# EasyEDA schematic KegWasher_1.8_LogicIO_Schematic.json
TITLE: Keg Washer Pi (Logic & IO) 1.8; REV: 1.8; Date: 2020-08-18; Sheet: 1/1; Drawn By: khultman; Company: Kyle Hultman
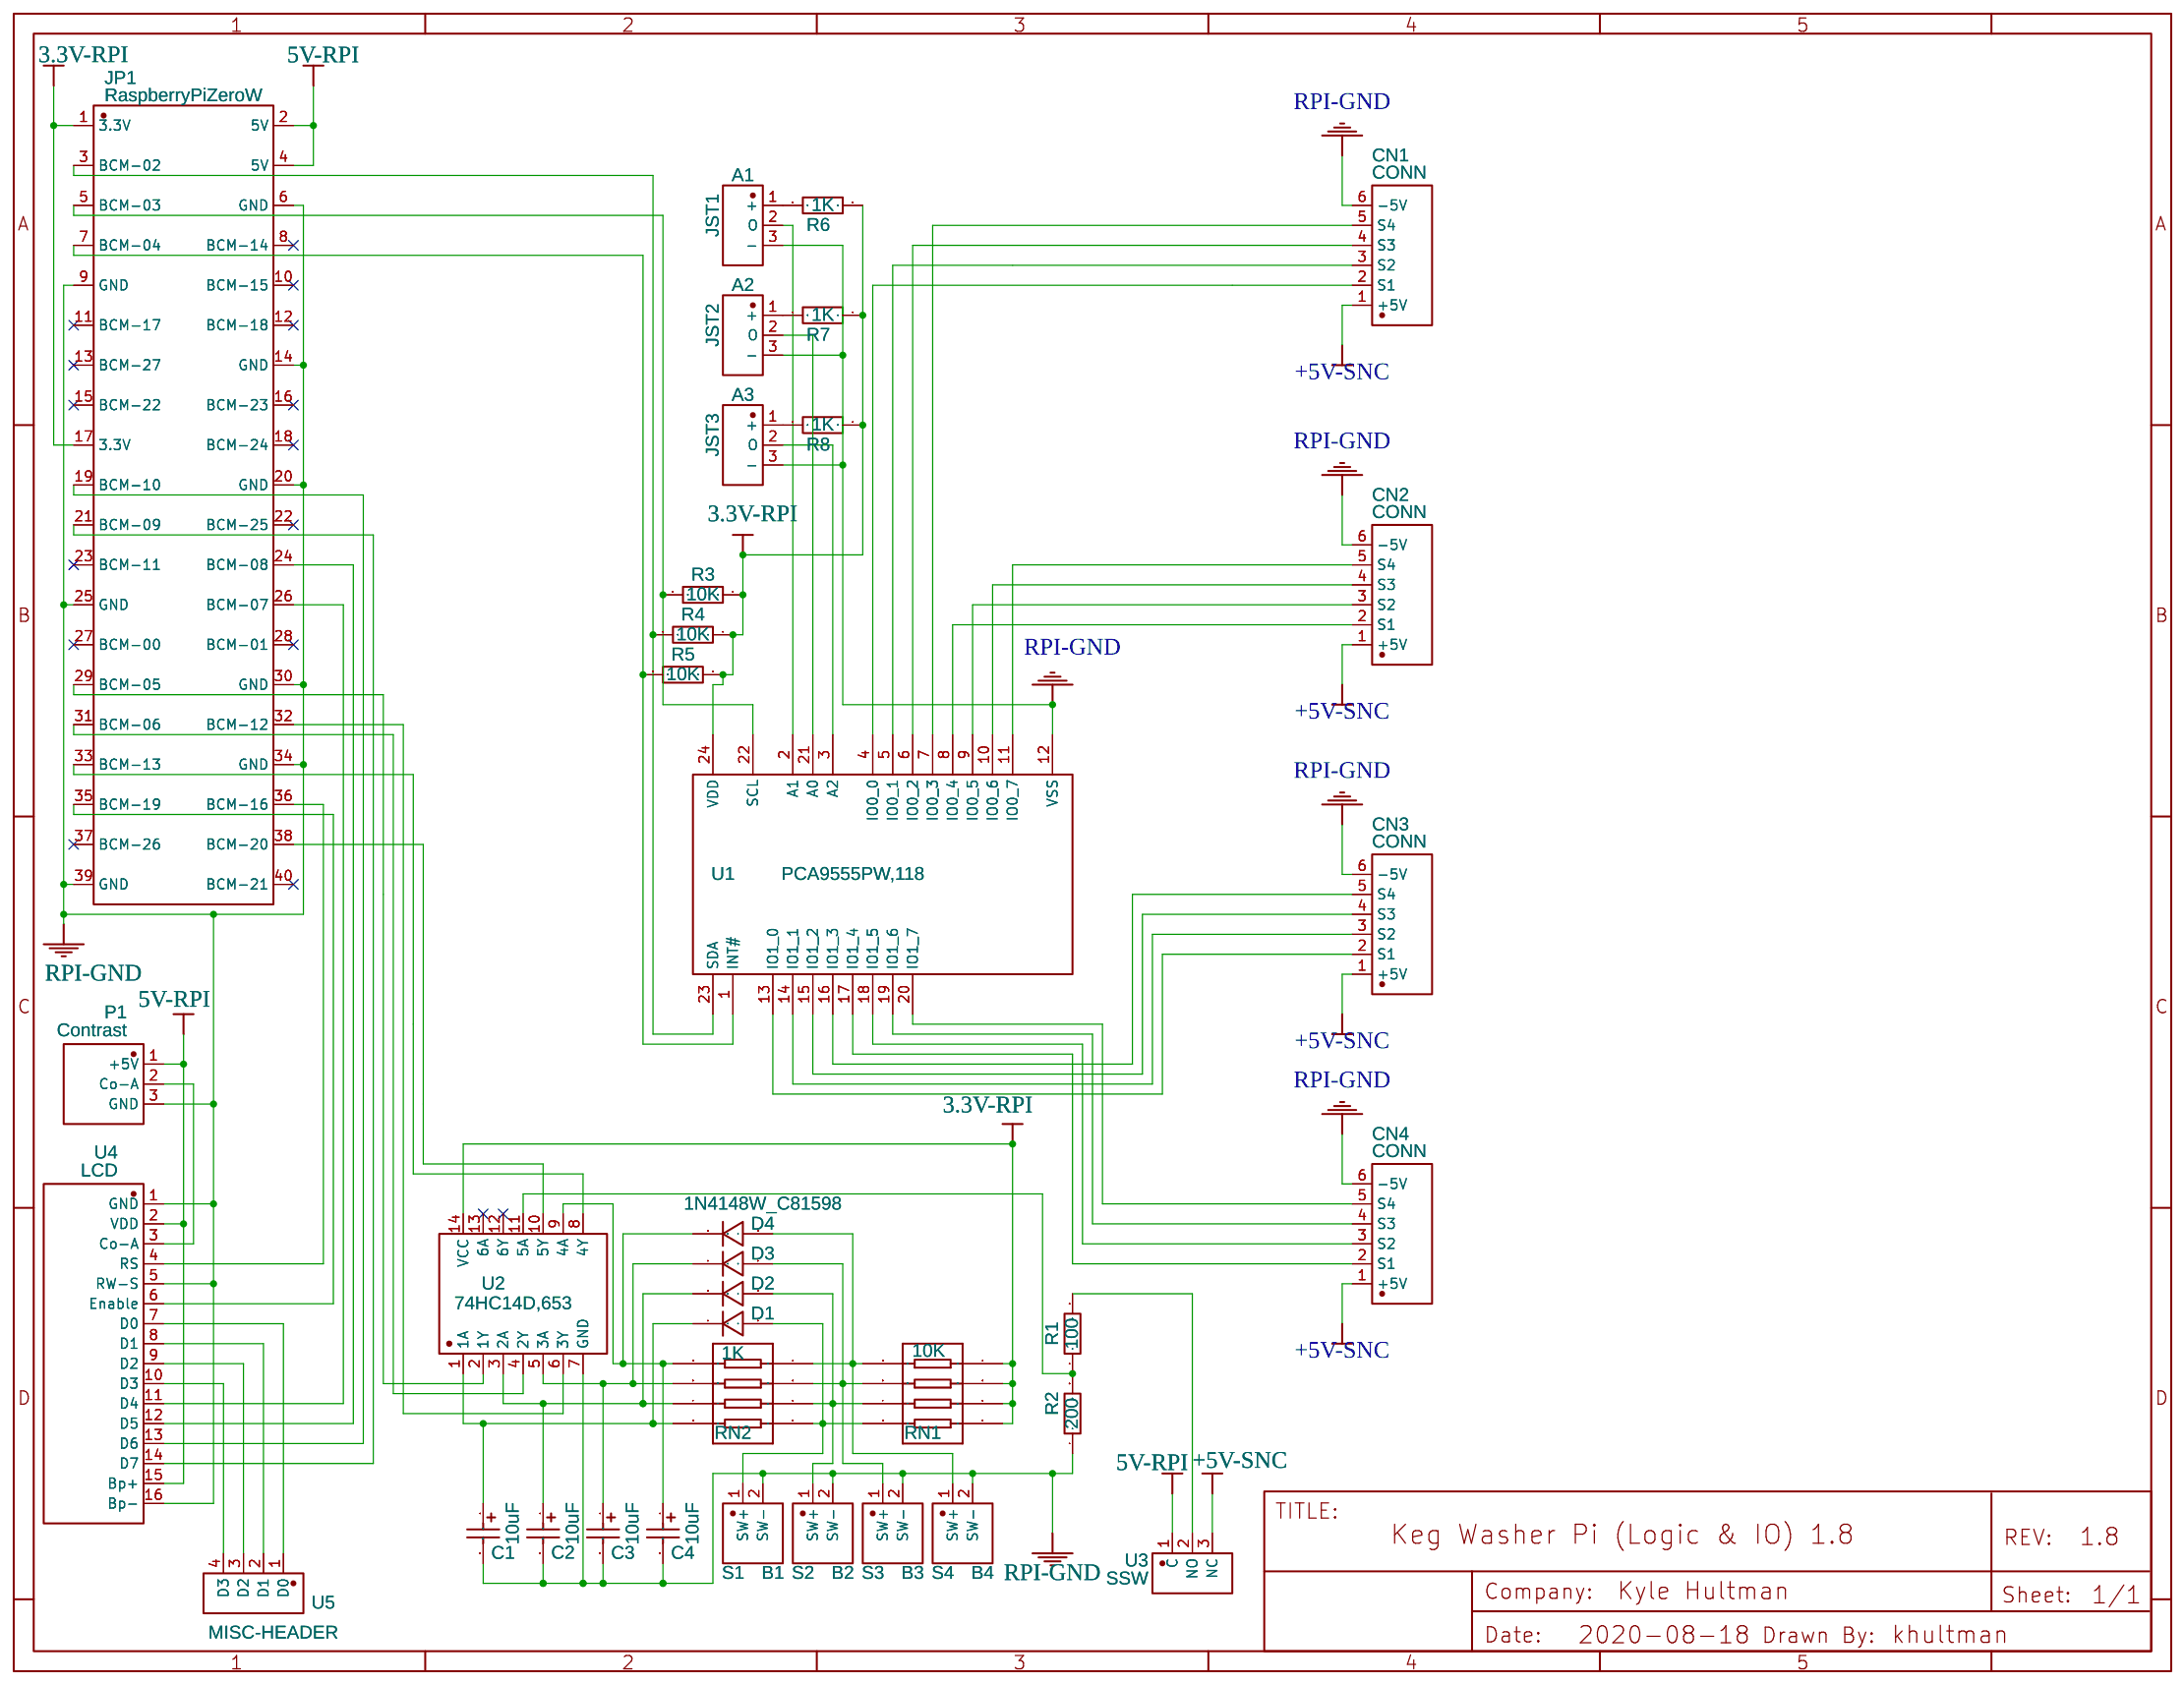
[diagram p0: schematic sheet]

## Parts
C1  10uF  [CAP-SMD_L3.2-W1.6-R-RD]
C2  10uF  [CAP-SMD_L3.2-W1.6-R-RD]
C3  10uF  [CAP-SMD_L3.2-W1.6-R-RD]
C4  10uF  [CAP-SMD_L3.2-W1.6-R-RD]
CN1  CONN  [6P]
CN2  CONN  [6P]
CN3  CONN  [6P]
CN4  CONN  [6P]
D1  1N4148W_C81598  [SOD-123_L2.8-W1.8-LS3.7-RD]
D2  1N4148W_C81598  [SOD-123_L2.8-W1.8-LS3.7-RD]
D3  1N4148W_C81598  [SOD-123_L2.8-W1.8-LS3.7-RD]
D4  1N4148W_C81598  [SOD-123_L2.8-W1.8-LS3.7-RD]
JP1  RaspberryPiZeroW  [2X20-SHROUDED]
JST1  A1  [3P]
JST2  A2  [3P]
JST3  A3  [3P]
P1  Contrast  [3P]
R1  100  [R1206]
R2  200  [R0603]
R3  10K  [R1206]
R4  10K  [R1206]
R5  10K  [R1206]
R6  1K  [R0805]
R7  1K  [R0805]
R8  1K  [R0805]
RN1  10K  [RES-ARRAY-SMD_0402-8P-L2.0-W1.0-BL]
RN2  1K  [RES-ARRAY-SMD_0402-8P-L2.0-W1.0-BL]
S1  B1  [2P]
S2  B2  [2P]
S3  B3  [2P]
S4  B4  [2P]
U1  PCA9555PW,118  [TSSOP-24_L7.8-W4.4-P0.65-LS6.4-BL]
U2  74HC14D,653  [SOIC-14_L8.7-W3.9-P1.27-LS6.0-BL]
U3  SSW  [3P]
U4  LCD  [HDR-M-2.54_1X16]
U5  MISC-HEADER  [HDR-M-2.54_1X4]

## Library data of the parts
C1-C4 = TAJA106K016RNJ: Supplier: LCSC; Manufacturer: AVX; LCSC Assembly: Yes; Supplier Part: C7171; SMT Type: Basic
CN1-CN4 = CONN
D1-D4 = 1N4148W_C81598: Supplier: LCSC; Manufacturer: SEMTECH; Manufacturer Part: 1N4148W; image: //image.lceda.cn/szlcsc/C81598.jpg; Supplier Part: C81598; LCSC Assembly: Yes; SMT Type: Basic
JP1 = RaspberryPiZeroW
JST1-JST3 = JST1
P1 = Contrast
R1 = 1206W4F1000T5E: Supplier: LCSC; Manufacturer: UniOhm; LCSC Assembly: Yes; Supplier Part: C17901; SMT Type: Basic
R2 = 0603WAF2000T5E: Supplier: LCSC; Manufacturer: UniOhm; LCSC Assembly: Yes; Supplier Part: C8218; SMT Type: Basic
R3-R5 = 1206W4F1002T5E: Supplier: LCSC; Manufacturer: UniOhm; LCSC Assembly: Yes; Supplier Part: C17902; SMT Type: Basic
R6-R8 = 0805W8F1001T5E: Supplier: LCSC; Manufacturer: UniOhm; LCSC Assembly: Yes; Supplier Part: C17513; SMT Type: Basic
RN1 = 4D02WGJ0103TCE: Supplier: LCSC; Manufacturer: UniOhm; LCSC Assembly: Yes; Supplier Part: C25725; SMT Type: Basic
RN2 = 4D02WGJ0102TCE: Supplier: LCSC; Manufacturer: UniOhm; LCSC Assembly: Yes; Supplier Part: C25726; SMT Type: Basic
S1-S4 = SW
U1 = PCA9555PW,118: Supplier: LCSC; Manufacturer: NXP; Contributor: LCSC; Supplier Part: C128392; LCSC Assembly: Yes; SMT Type: Extend
U2 = 74HC14D,653: Supplier: LCSC; Manufacturer: Nexperia; LCSC Assembly: Yes; image: //image.lceda.cn/szlcsc/C5605.jpg; Supplier Part: C5605; SMT Type: Basic
U3 = SSW
U4 = LCD
U5 = MISC-HEADER

## Nets
3.3V-RPI: JP1.1(3.3V) JP1.17(3.3V) R3.1 R4.1 R5.1 R6.1 R7.1 R8.1 RN1.1 RN1.2 RN1.3 RN1.4 U1.24(VDD) U2.14(VCC)
5V-RPI: JP1.2(5V) JP1.4(5V) P1.1(+5V) U3.1(C) U4.2(VDD) U4.15(Bp+)
+5V-SNC: CN1.1(+5V) CN2.1(+5V) CN3.1(+5V) CN4.1(+5V) U3.3(NC)
RPI-GND: C1.2 C2.2 C3.2 C4.2 CN1.6(-5V) CN2.6(-5V) CN3.6(-5V) CN4.6(-5V) JP1.6(GND) JP1.9(GND) JP1.14(GND) JP1.20(GND) JP1.25(GND) JP1.30(GND) JP1.34(GND) JP1.39(GND) JST1.3(-) JST2.3(-) JST3.3(-) P1.3(GND) R2.1 S1.2(SW-) S2.2(SW-) S3.2(SW-) S4.2(SW-) U1.12(VSS) U2.7(GND) U4.1(GND) U4.5(RW-S) U4.16(Bp-)
Net-(C1-1): C1.1 D1.1(K) RN2.8 U2.1(1A)
Net-(C2-1): C2.1 D2.1(K) RN2.7 U2.3(2A)
Net-(C3-1): C3.1 D3.1(K) RN2.6 U2.5(3A)
Net-(C4-1): C4.1 D4.1(K) RN2.5 U2.9(4A)
Net-(CN1-2): CN1.2(S1) U1.4(IO0_0)
Net-(CN1-3): CN1.3(S2) U1.5(IO0_1)
Net-(CN1-4): CN1.4(S3) U1.6(IO0_2)
Net-(CN1-5): CN1.5(S4) U1.7(IO0_3)
Net-(CN2-2): CN2.2(S1) U1.8(IO0_4)
Net-(CN2-3): CN2.3(S2) U1.9(IO0_5)
Net-(CN2-4): CN2.4(S3) U1.10(IO0_6)
Net-(CN2-5): CN2.5(S4) U1.11(IO0_7)
Net-(CN3-2): CN3.2(S1) U1.13(IO1_0)
Net-(CN3-3): CN3.3(S2) U1.14(IO1_1)
Net-(CN3-4): CN3.4(S3) U1.15(IO1_2)
Net-(CN3-5): CN3.5(S4) U1.16(IO1_3)
Net-(CN4-2): CN4.2(S1) U1.17(IO1_4)
Net-(CN4-3): CN4.3(S2) U1.18(IO1_5)
Net-(CN4-4): CN4.4(S3) U1.19(IO1_6)
Net-(CN4-5): CN4.5(S4) U1.20(IO1_7)
Net-(D1-2): D1.2(A) RN1.8 RN2.1 S1.1(SW+)
Net-(D2-2): D2.2(A) RN1.7 RN2.2 S2.1(SW+)
Net-(D3-2): D3.2(A) RN1.6 RN2.3 S3.1(SW+)
Net-(D4-2): D4.2(A) RN1.5 RN2.4 S4.1(SW+)
Net-(JP1-3): JP1.3(BCM-02) R4.2 U1.23(SDA)
Net-(JP1-5): JP1.5(BCM-03) R3.2 U1.22(SCL)
Net-(JP1-7): JP1.7(BCM-04) R5.2 U1.1(INT#)
Net-(JP1-19): JP1.19(BCM-10) U4.13(D6)
Net-(JP1-21): JP1.21(BCM-09) U4.14(D7)
Net-(JP1-24): JP1.24(BCM-08) U4.12(D5)
Net-(JP1-26): JP1.26(BCM-07) U4.11(D4)
Net-(JP1-29): JP1.29(BCM-05) U2.2(1Y)
Net-(JP1-31): JP1.31(BCM-06) U2.4(2Y)
Net-(JP1-32): JP1.32(BCM-12) U2.6(3Y)
Net-(JP1-33): JP1.33(BCM-13) U2.8(4Y)
Net-(JP1-35): JP1.35(BCM-19) U4.6(Enable)
Net-(JP1-36): JP1.36(BCM-16) U4.4(RS)
Net-(JP1-38): JP1.38(BCM-20) U2.10(5Y)
Net-(JST1-1): JST1.1(+) R6.2
Net-(JST1-2): JST1.2(O) U1.2(A1)
Net-(JST2-1): JST2.1(+) R7.2
Net-(JST2-2): JST2.2(O) U1.21(A0)
Net-(JST3-1): JST3.1(+) R8.2
Net-(JST3-2): JST3.2(O) U1.3(A2)
Net-(P1-2): P1.2(Co-A) U4.3(Co-A)
Net-(R1-1): R1.1 R2.2 U2.11(5A)
Net-(R1-2): R1.2 U3.2(NO)
Net-(U4-7): U4.7(D0) U5.1(D0)
Net-(U4-8): U4.8(D1) U5.2(D1)
Net-(U4-9): U4.9(D2) U5.3(D2)
Net-(U4-10): U4.10(D3) U5.4(D3)

Not connected (* = marked no-connect by the designer): JP1 8(BCM-14)* 10(BCM-15)* 11(BCM-17)* 12(BCM-18)* 13(BCM-27)* 15(BCM-22)* 16(BCM-23)* 18(BCM-24)* 22(BCM-25)* 23(BCM-11)* 27(BCM-00)* 28(BCM-01)* 37(BCM-26)* 40(BCM-21)*; U2 12(6Y)* 13(6A)*
